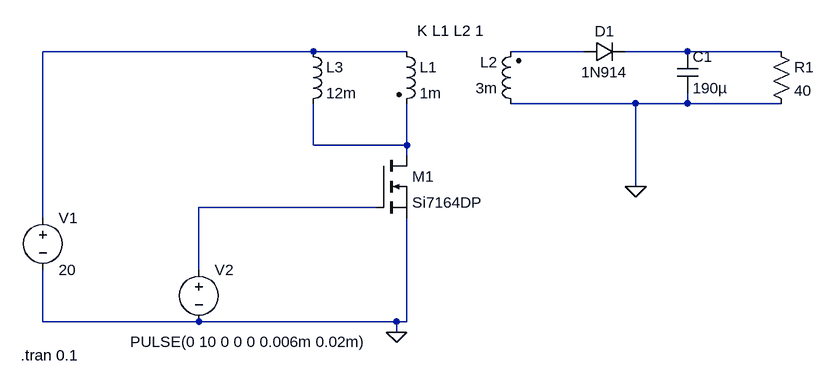
[diagram p0: schematic flyback.asc]
flyback.asc, the LTspice schematic file:
Version 4
SHEET 1 1240 680
WIRE 416 -144 0 -144
WIRE 560 -144 416 -144
WIRE 832 -144 720 -144
WIRE 992 -144 896 -144
WIRE 1136 -144 992 -144
WIRE 912 -64 720 -64
WIRE 992 -64 992 -80
WIRE 992 -64 912 -64
WIRE 1136 -64 992 -64
WIRE 416 0 416 -64
WIRE 560 0 560 -64
WIRE 560 0 416 0
WIRE 560 16 560 0
WIRE 912 64 912 -64
WIRE 512 96 240 96
WIRE 0 112 0 -144
WIRE 240 192 240 96
WIRE 0 272 0 192
WIRE 240 272 0 272
WIRE 544 272 240 272
WIRE 560 272 560 112
WIRE 560 272 544 272
WIRE 544 288 544 272
FLAG 912 64 0
FLAG 544 288 0
SYMBOL voltage 0 96 R0
SYMATTR InstName V1
SYMATTR Value 20
SYMBOL voltage 240 176 R0
WINDOW 3 -106 127 Left 2
WINDOW 123 0 0 Left 0
WINDOW 39 0 0 Left 0
SYMATTR InstName V2
SYMATTR Value PULSE(0 10 0 0 0 0.006m 0.02m)
SYMBOL nmos 512 16 R0
SYMATTR InstName M1
SYMATTR Value Si7164DP
SYMBOL ind2 544 -160 R0
SYMATTR InstName L1
SYMATTR Value 1m
SYMATTR Type ind
SYMBOL ind2 736 -48 R180
WINDOW 0 36 80 Left 2
WINDOW 3 36 40 Left 2
SYMATTR InstName L2
SYMATTR Value 3m
SYMATTR Type ind
SYMBOL diode 832 -128 R270
WINDOW 0 32 32 VTop 2
WINDOW 3 0 32 VBottom 2
SYMATTR InstName D1
SYMATTR Value 1N914
SYMBOL res 1120 -160 R0
SYMATTR InstName R1
SYMATTR Value 40
SYMBOL cap 976 -144 R0
SYMATTR InstName C1
SYMATTR Value 190µ
SYMBOL ind 400 -160 R0
SYMATTR InstName L3
SYMATTR Value 12m
TEXT 576 -176 Left 2 !K L1 L2 1
TEXT -34 324 Left 2 !.tran 0.1

The netlist it stands for:
* flyback.asc
V1 N001 0 20
V2 N005 0 PULSE(0 10 0 0 0 0.006m 0.02m)
M1 N004 N005 0 0 Si7164DP
L1 N001 N004 1m
L2 0 N002 3m
D1 N002 N003 1N914
R1 N003 0 40
C1 N003 0 190µ
L3 N001 N004 12m
.model D D
.lib standard.dio
.model NMOS NMOS
.model PMOS PMOS
.lib standard.mos
K L1 L2 1
.tran 0.1
.backanno
.end